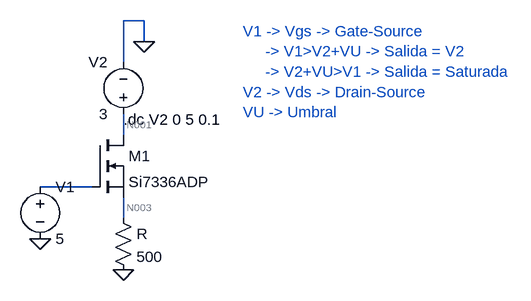
[diagram p0: schematic nmos.asc]
nmos.asc, the LTspice schematic file:
Version 4.1
SHEET 1 880 680
WIRE 176 -2192 144 -2192
WIRE 176 -2160 176 -2192
WIRE 144 -2128 144 -2192
WIRE 144 -2016 144 -2048
WIRE 96 -1936 16 -1936
WIRE 144 -1888 144 -1920
FLAG 16 -1856 0
FLAG 176 -2160 0
FLAG 144 -1808 0
SYMBOL nmos 96 -2016 R0
SYMATTR InstName M1
SYMATTR Value Si7336ADP
SYMBOL voltage 16 -1952 R0
WINDOW 123 0 0 Left 0
WINDOW 39 0 0 Left 0
SYMATTR InstName V1
SYMATTR Value 5
SYMBOL voltage 144 -2032 R180
WINDOW 0 24 96 Left 2
WINDOW 3 24 16 Left 2
WINDOW 123 0 0 Left 0
WINDOW 39 0 0 Left 0
SYMATTR InstName V2
SYMATTR Value 3
SYMBOL res 128 -1904 R0
SYMATTR InstName R
SYMATTR Value 500
TEXT 144 -2040 Left 2 !.dc V2 0 5 0.1
TEXT 328 -2176 Left 2 ;V1 -> Vgs -> Gate-Source \n     -> V1>V2+VU -> Salida = V2\n     -> V2+VU>V1 -> Salida = Saturada\nV2 -> Vds -> Drain-Source\nVU -> Umbral

The netlist it stands for:
* nmos.asc
M1 N001 N002 N003 N003 Si7336ADP
V1 N002 0 5
V2 N001 0 3
R N003 0 500
.model NMOS NMOS
.model PMOS PMOS
.lib standard.mos
.dc V2 0 5 0.1
* V1 -> Vgs -> Gate-Source
*      -> V1>V2+VU -> Salida = V2
*      -> V2+VU>V1 -> Salida = Saturada
* V2 -> Vds -> Drain-Source
* VU -> Umbral
.backanno
.end

* Results of the author's LTspice run, read from the files saved beside the schematic
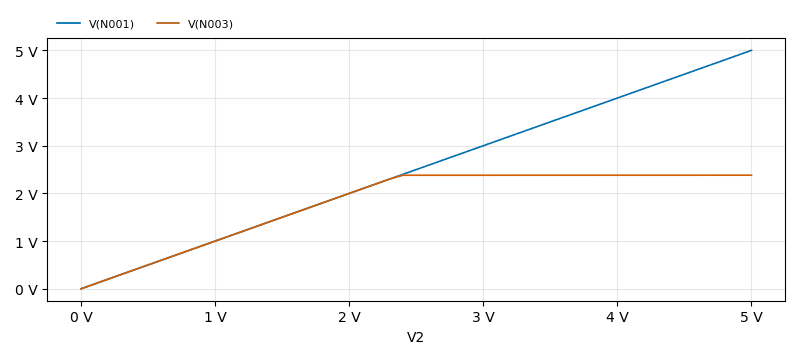
[diagram p1: DC transfer characteristic of nmos.asc, plotted from the saved traces]
* DC transfer characteristic, 1 run:
*   V(N001): 0 V at V2=0 V, 5 V at V2=5 V, min 0 V, max 5 V
*   V(N003): -1.208e-19 fV at V2=0 V, 2.383 V at V2=5 V, min -1.208e-19 fV, max 2.383 V